# Altium schematic sheet Q24_BRAKE_LIGHT.SchDoc
size A4; SheetNumber: 1; SheetTotal: 1
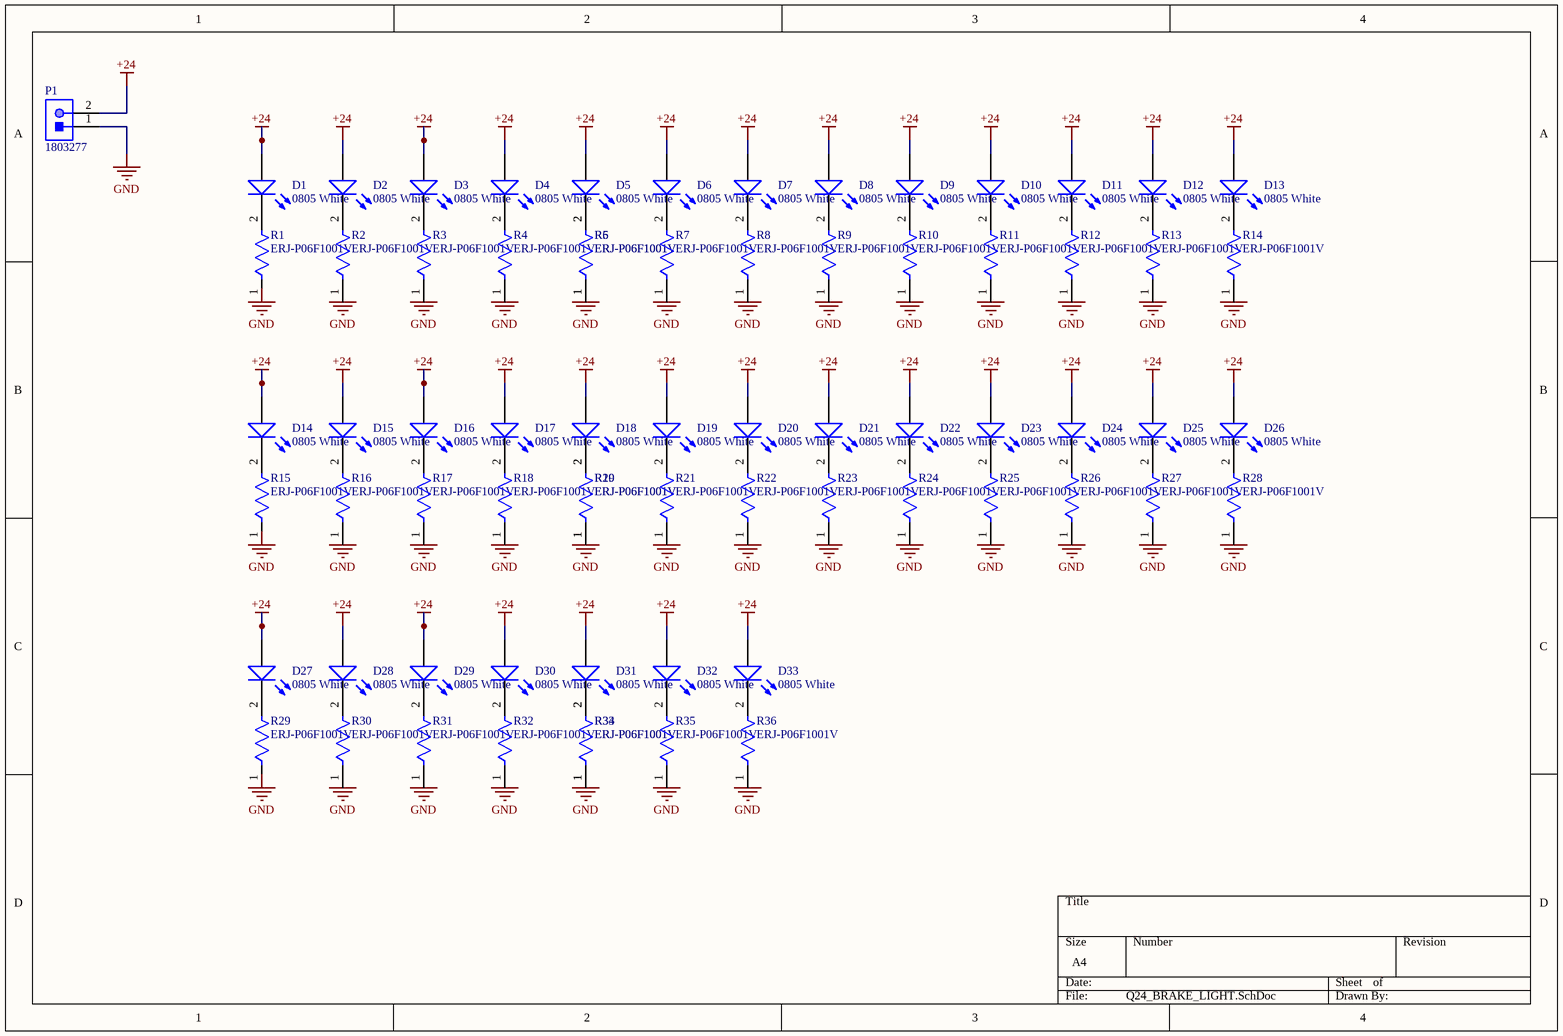
[diagram p0: Q24_BRAKE_LIGHT.SchDoc]

## Parts
D1  0805 White  [0805_LED_S1]
D2  0805 White  [0805_LED_S1]
D3  0805 White  [0805_LED_S1]
D4  0805 White  [0805_LED_S1]
D5  0805 White  [0805_LED_S1]
D6  0805 White  [0805_LED_S1]
D7  0805 White  [0805_LED_S1]
D8  0805 White  [0805_LED_S1]
D9  0805 White  [0805_LED_S1]
D10  0805 White  [0805_LED_S1]
D11  0805 White  [0805_LED_S1]
D12  0805 White  [0805_LED_S1]
D13  0805 White  [0805_LED_S1]
D14  0805 White  [0805_LED_S1]
D15  0805 White  [0805_LED_S1]
D16  0805 White  [0805_LED_S1]
D17  0805 White  [0805_LED_S1]
D18  0805 White  [0805_LED_S1]
D19  0805 White  [0805_LED_S1]
D20  0805 White  [0805_LED_S1]
D21  0805 White  [0805_LED_S1]
D22  0805 White  [0805_LED_S1]
D23  0805 White  [0805_LED_S1]
D24  0805 White  [0805_LED_S1]
D25  0805 White  [0805_LED_S1]
D26  0805 White  [0805_LED_S1]
D27  0805 White  [0805_LED_S1]
D28  0805 White  [0805_LED_S1]
D29  0805 White  [0805_LED_S1]
D30  0805 White  [0805_LED_S1]
D31  0805 White  [0805_LED_S1]
D32  0805 White  [0805_LED_S1]
D33  0805 White  [0805_LED_S1]
P1  1803277  [PHOE-1803277_V]
R1  ERJ-P06F1001V  [FP-ERJP06-IPC_C]
R2  ERJ-P06F1001V  [FP-ERJP06-IPC_C]
R3  ERJ-P06F1001V  [FP-ERJP06-IPC_C]
R4  ERJ-P06F1001V  [FP-ERJP06-IPC_C]
R5  ERJ-P06F1001V  [FP-ERJP06-IPC_C]
R6  ERJ-P06F1001V  [FP-ERJP06-IPC_C]
R7  ERJ-P06F1001V  [FP-ERJP06-IPC_C]
R8  ERJ-P06F1001V  [FP-ERJP06-IPC_C]
R9  ERJ-P06F1001V  [FP-ERJP06-IPC_C]
R10  ERJ-P06F1001V  [FP-ERJP06-IPC_C]
R11  ERJ-P06F1001V  [FP-ERJP06-IPC_C]
R12  ERJ-P06F1001V  [FP-ERJP06-IPC_C]
R13  ERJ-P06F1001V  [FP-ERJP06-IPC_C]
R14  ERJ-P06F1001V  [FP-ERJP06-IPC_C]
R15  ERJ-P06F1001V  [FP-ERJP06-IPC_C]
R16  ERJ-P06F1001V  [FP-ERJP06-IPC_C]
R17  ERJ-P06F1001V  [FP-ERJP06-IPC_C]
R18  ERJ-P06F1001V  [FP-ERJP06-IPC_C]
R19  ERJ-P06F1001V  [FP-ERJP06-IPC_C]
R20  ERJ-P06F1001V  [FP-ERJP06-IPC_C]
R21  ERJ-P06F1001V  [FP-ERJP06-IPC_C]
R22  ERJ-P06F1001V  [FP-ERJP06-IPC_C]
R23  ERJ-P06F1001V  [FP-ERJP06-IPC_C]
R24  ERJ-P06F1001V  [FP-ERJP06-IPC_C]
R25  ERJ-P06F1001V  [FP-ERJP06-IPC_C]
R26  ERJ-P06F1001V  [FP-ERJP06-IPC_C]
R27  ERJ-P06F1001V  [FP-ERJP06-IPC_C]
R28  ERJ-P06F1001V  [FP-ERJP06-IPC_C]
R29  ERJ-P06F1001V  [FP-ERJP06-IPC_C]
R30  ERJ-P06F1001V  [FP-ERJP06-IPC_C]
R31  ERJ-P06F1001V  [FP-ERJP06-IPC_C]
R32  ERJ-P06F1001V  [FP-ERJP06-IPC_C]
R33  ERJ-P06F1001V  [FP-ERJP06-IPC_C]
R34  ERJ-P06F1001V  [FP-ERJP06-IPC_C]
R35  ERJ-P06F1001V  [FP-ERJP06-IPC_C]
R36  ERJ-P06F1001V  [FP-ERJP06-IPC_C]

## Nets
+24: D1.A D2.A D3.A D4.A D5.A D6.A D7.A D8.A D9.A D10.A D11.A D12.A D13.A D14.A D15.A D16.A D17.A D18.A D19.A D20.A D21.A D22.A D23.A D24.A D25.A D26.A D27.A D28.A D29.A D30.A D31.A D32.A D33.A P1.2
GND: P1.1
NetR5_1: R5.1 R6.1
NetR5_2: R5.2 R6.2
NetR19_1: R19.1 R20.1
NetR19_2: R19.2 R20.2
NetR33_1: R33.1 R34.1
NetR33_2: R33.2 R34.2

Not connected (* = marked no-connect by the designer): D1 K; D2 K; D3 K; D4 K; D5 K; D6 K; D7 K; D8 K; D9 K; D10 K; D11 K; D12 K; D13 K; D14 K; D15 K; D16 K; D17 K; D18 K; D19 K; D20 K; D21 K; D22 K; D23 K; D24 K; D25 K; D26 K; D27 K; D28 K; D29 K; D30 K; D31 K; D32 K; D33 K; R1 1 2; R2 1 2; R3 1 2; R4 1 2; R7 1 2; R8 1 2; R9 1 2; R10 1 2; R11 1 2; R12 1 2; R13 1 2; R14 1 2; R15 1 2; R16 1 2; R17 1 2; R18 1 2; R21 1 2; R22 1 2; R23 1 2; R24 1 2; R25 1 2; R26 1 2; R27 1 2; R28 1 2; R29 1 2; R30 1 2; R31 1 2; R32 1 2; R35 1 2; R36 1 2

## Notes on the sheet
- Labels drawn without touching a wire or pin: GND

## Library data of the parts
D1-D33 = 0805 LED White: LED; ComponentLink1Description: 供应商链接; ComponentLink1URL: http://www.szlcsc.com/product/details_35468.html; Package: 0805; Supplier: LC; SuppliersPartNumber: C34499; Color: White
P1 = CMP-002-00014-2: Male Header, Pitch 3.81 mm, 1 x 2 Position, Height 7.25 mm, Tail Length 3.4 mm, RoHS, Bulk; Manufacturer: Phoenix Contact; Voltage Rating: 160V; Current Rating: 8A; Rows: 1; Mounting Technology: TH; Contact Plating: Tin; Case/Package: 1803277; Gender: Male; Diameter: 7.25mm; Datasheet Version: Feb-14; Colour: Green; Pins: 2; Lead Pitch: 0.15inch; Connector Type: Header; Package Quantity: 50; Max Current Rating: 8A; Manufacturer URL: http://www.phoenixcontact.com/; Packaging: Bulk; RoHS Compliant: True; Datasheet URL: https://datasheet.ciiva.com/16096/1803277-16096845.pdf; Package Reference: 1803277; Package Description: Male Header, Pitch 3.81 mm, 1 x 2 Position, Height 7.25 mm, Tail Length 3.4 mm
R1-R36 = CMP-05422-000125-1: RES SMD 1K OHM 1% 1/2W 0805; Temperature Coefficient: 100ppm/°C; Max Power Dissipation: 500mW; Voltage Rating: 150V; Resistance: 1kR; Case Code (Metric): 2012; Max Operating Temperature: 155°C; REACH SVHC: No SVHC; Mount: Surface Mount; Military Standard: Not; Package Quantity: 5000; Series: ERJ; Height: 0.6mm; Radiation Hardening: No; Termination: Tab; Number of Terminations: 2; Length: 2mm; Resistance Tolerance: 1%; Voltage Rating (DC): 150V; Depth: 1.25mm; Construction: Rectangular; Resistor Type: Thick Film; Packaging: Tape and Reel; Contact Plating: Tin; RoHS Compliant: Yes; Features: Automotive AEC-Q200; Number of Pins: 2; Case Code (Imperial): 0805; Technology: THICK FILM; Width: 1.2mm; Case/Package: 0805; Min Operating Temperature: -55°C; Power Rating: 500mW; Tolerance: 1%